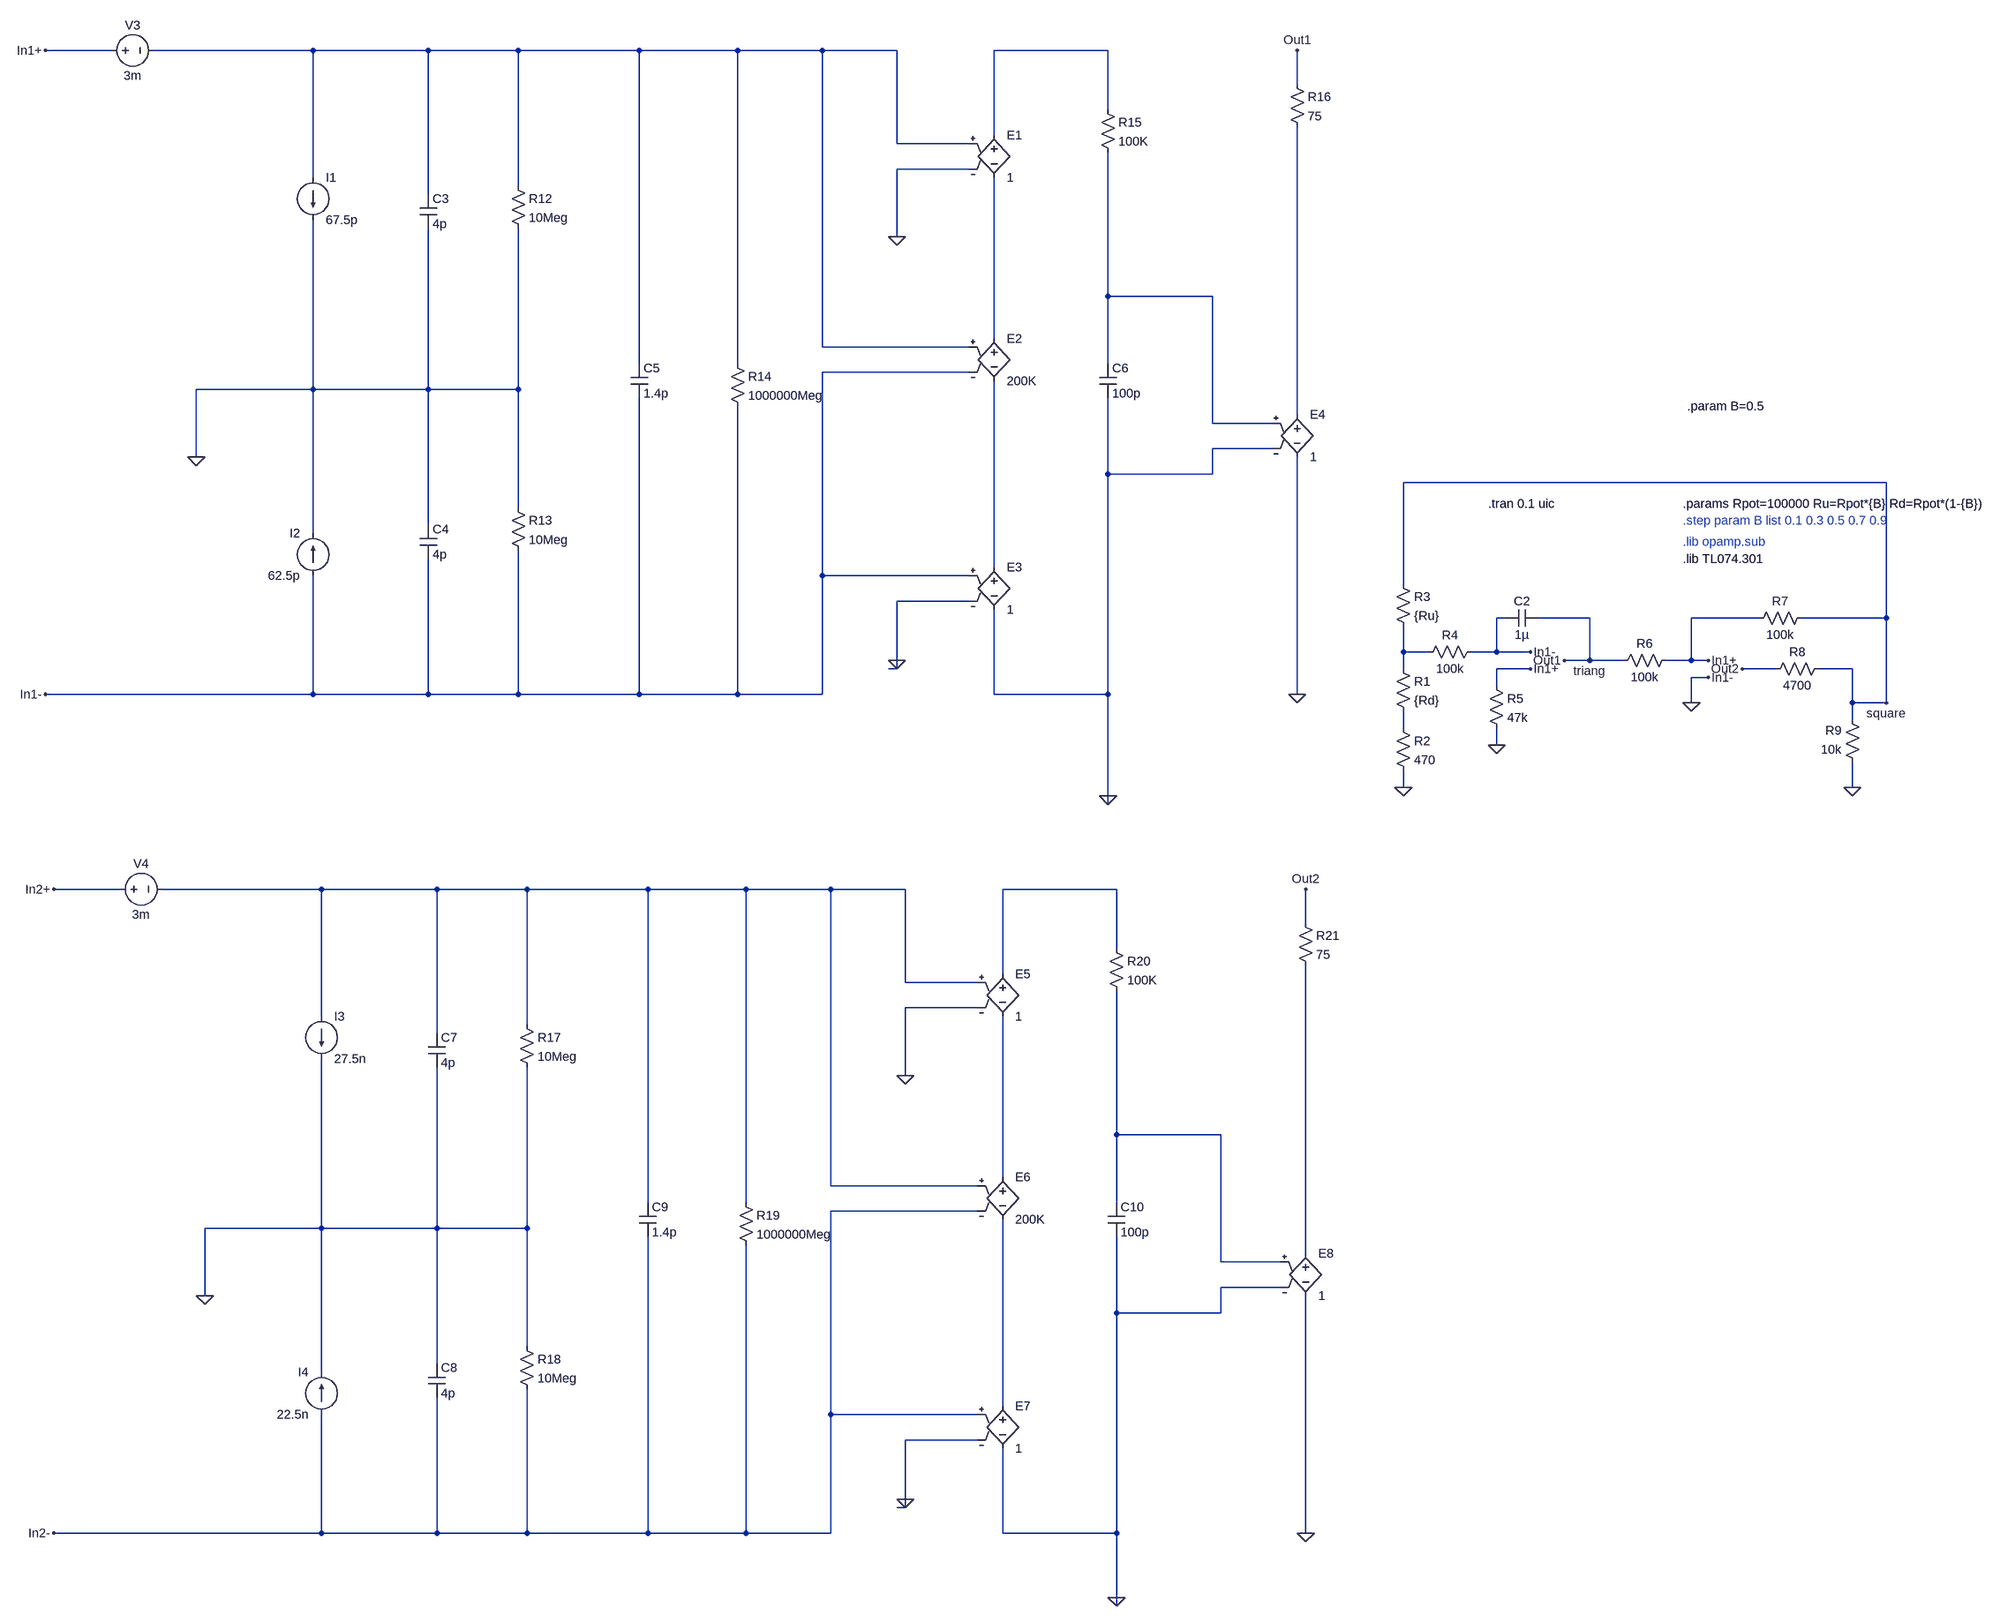
[diagram p0: schematic LFO_macromodel.asc]
LFO_macromodel.asc, the LTspice schematic file:
Version 4
SHEET 1 1796 2212
WIRE -3808 -800 -3936 -800
WIRE -3424 -800 -3728 -800
WIRE -3008 -800 -3424 -800
WIRE -2608 -800 -3008 -800
WIRE -2288 -800 -2608 -800
WIRE -1984 -800 -2288 -800
WIRE -1824 -800 -1984 -800
WIRE -1600 -800 -1824 -800
WIRE -1008 -800 -1408 -800
WIRE -384 -736 -384 -800
WIRE -1008 -688 -1008 -800
WIRE -1408 -640 -1408 -800
WIRE -1600 -624 -1600 -800
WIRE -1456 -624 -1600 -624
WIRE -1456 -576 -1600 -576
WIRE -3424 -560 -3424 -800
WIRE -2608 -544 -2608 -800
WIRE -3008 -528 -3008 -800
WIRE -1600 -448 -1600 -576
WIRE -1600 -448 -1616 -448
WIRE -1008 -336 -1008 -608
WIRE -544 -336 -1008 -336
WIRE -1408 -256 -1408 -560
WIRE -1824 -240 -1824 -800
WIRE -1456 -240 -1824 -240
WIRE -2288 -208 -2288 -800
WIRE -1984 -208 -1984 -800
WIRE -1008 -208 -1008 -336
WIRE -1456 -192 -1824 -192
WIRE -3424 -160 -3424 -480
WIRE -3424 -160 -3648 -160
WIRE -3008 -160 -3008 -464
WIRE -3008 -160 -3424 -160
WIRE -2608 -160 -2608 -464
WIRE -2608 -160 -3008 -160
WIRE -384 -112 -384 -656
WIRE -544 -96 -544 -336
WIRE -432 -96 -544 -96
WIRE -432 -48 -544 -48
WIRE -3648 -32 -3648 -160
WIRE -1008 0 -1008 -144
WIRE -544 0 -544 -48
WIRE -544 0 -1008 0
WIRE 880 16 -32 16
WIRE -2608 64 -2608 -160
WIRE -3008 96 -3008 -160
WIRE -3424 112 -3424 -160
WIRE -1408 176 -1408 -176
WIRE -1824 192 -1824 -192
WIRE -1456 192 -1824 192
WIRE -32 208 -32 16
WIRE -1456 240 -1600 240
WIRE 160 272 144 272
WIRE 320 272 224 272
WIRE 640 272 512 272
WIRE 880 272 880 16
WIRE 880 272 720 272
WIRE -32 336 -32 288
WIRE 16 336 -32 336
WIRE 144 336 144 272
WIRE 144 336 96 336
WIRE 208 336 144 336
WIRE -1600 352 -1600 240
WIRE 320 352 320 272
WIRE 320 352 272 352
WIRE 384 352 320 352
WIRE 512 352 512 272
WIRE 512 352 464 352
WIRE 544 352 512 352
WIRE -1600 368 -1600 352
WIRE -1600 368 -1616 368
WIRE -32 368 -32 336
WIRE 208 368 144 368
WIRE 672 368 608 368
WIRE 816 368 752 368
WIRE 544 384 512 384
WIRE 144 400 144 368
WIRE -3424 416 -3424 192
WIRE -3424 416 -3936 416
WIRE -3008 416 -3008 160
WIRE -3008 416 -3424 416
WIRE -2608 416 -2608 144
WIRE -2608 416 -3008 416
WIRE -2288 416 -2288 -144
WIRE -2288 416 -2608 416
WIRE -1984 416 -1984 -128
WIRE -1984 416 -2288 416
WIRE -1824 416 -1824 192
WIRE -1824 416 -1984 416
WIRE -1408 416 -1408 256
WIRE -1008 416 -1008 0
WIRE -1008 416 -1408 416
WIRE -384 416 -384 -32
WIRE 512 432 512 384
WIRE 816 432 816 368
WIRE 880 432 880 272
WIRE 880 432 816 432
WIRE 816 464 816 432
WIRE -32 480 -32 448
WIRE 144 512 144 480
WIRE -32 592 -32 560
WIRE 816 592 816 544
WIRE -1008 608 -1008 416
WIRE -1008 624 -1008 608
WIRE -3792 784 -3920 784
WIRE -3408 784 -3712 784
WIRE -2992 784 -3408 784
WIRE -2592 784 -2992 784
WIRE -2272 784 -2592 784
WIRE -1968 784 -2272 784
WIRE -1808 784 -1968 784
WIRE -1584 784 -1808 784
WIRE -992 784 -1392 784
WIRE -368 848 -368 784
WIRE -992 896 -992 784
WIRE -1392 944 -1392 784
WIRE -1584 960 -1584 784
WIRE -1440 960 -1584 960
WIRE -1440 1008 -1584 1008
WIRE -3408 1024 -3408 784
WIRE -2592 1040 -2592 784
WIRE -2992 1056 -2992 784
WIRE -1584 1136 -1584 1008
WIRE -1584 1136 -1600 1136
WIRE -992 1248 -992 976
WIRE -528 1248 -992 1248
WIRE -1392 1328 -1392 1024
WIRE -1808 1344 -1808 784
WIRE -1440 1344 -1808 1344
WIRE -2272 1376 -2272 784
WIRE -1968 1376 -1968 784
WIRE -992 1376 -992 1248
WIRE -1440 1392 -1808 1392
WIRE -3408 1424 -3408 1104
WIRE -3408 1424 -3632 1424
WIRE -2992 1424 -2992 1120
WIRE -2992 1424 -3408 1424
WIRE -2592 1424 -2592 1120
WIRE -2592 1424 -2992 1424
WIRE -368 1472 -368 928
WIRE -528 1488 -528 1248
WIRE -416 1488 -528 1488
WIRE -416 1536 -528 1536
WIRE -3632 1552 -3632 1424
WIRE -992 1584 -992 1440
WIRE -528 1584 -528 1536
WIRE -528 1584 -992 1584
WIRE -2592 1648 -2592 1424
WIRE -2992 1680 -2992 1424
WIRE -3408 1696 -3408 1424
WIRE -1392 1760 -1392 1408
WIRE -1808 1776 -1808 1392
WIRE -1440 1776 -1808 1776
WIRE -1440 1824 -1584 1824
WIRE -1584 1936 -1584 1824
WIRE -1584 1952 -1584 1936
WIRE -1584 1952 -1600 1952
WIRE -3408 2000 -3408 1776
WIRE -3408 2000 -3920 2000
WIRE -2992 2000 -2992 1744
WIRE -2992 2000 -3408 2000
WIRE -2592 2000 -2592 1728
WIRE -2592 2000 -2992 2000
WIRE -2272 2000 -2272 1440
WIRE -2272 2000 -2592 2000
WIRE -1968 2000 -1968 1456
WIRE -1968 2000 -2272 2000
WIRE -1808 2000 -1808 1776
WIRE -1808 2000 -1968 2000
WIRE -1392 2000 -1392 1840
WIRE -992 2000 -992 1584
WIRE -992 2000 -1392 2000
WIRE -368 2000 -368 1552
WIRE -992 2192 -992 2000
WIRE -992 2208 -992 2192
FLAG -32 592 0
FLAG 144 512 0
FLAG 512 432 0
FLAG 816 592 0
FLAG 320 352 triang
FLAG 880 432 square
FLAG -1008 608 0
FLAG -384 416 0
FLAG -3648 -32 0
FLAG -1600 -448 0
FLAG -1600 352 0
FLAG -3936 -800 In1+
FLAG -3936 416 In1-
FLAG -384 -800 Out1
FLAG -992 2192 0
FLAG -368 2000 0
FLAG -3632 1552 0
FLAG -1584 1136 0
FLAG -1584 1936 0
FLAG -3920 784 In2+
FLAG -3920 2000 In2-
FLAG -368 784 Out2
FLAG 208 368 In1+
FLAG 208 336 In1-
FLAG 272 352 Out1
FLAG 544 352 In1+
FLAG 544 384 In1-
FLAG 608 368 Out2
SYMBOL res -48 352 R0
SYMATTR InstName R1
SYMATTR Value {Rd}
SYMBOL res -48 464 R0
SYMATTR InstName R2
SYMATTR Value 470
SYMBOL res -48 192 R0
SYMATTR InstName R3
SYMATTR Value {Ru}
SYMBOL res 112 320 R90
WINDOW 0 0 56 VBottom 2
WINDOW 3 32 56 VTop 2
SYMATTR InstName R4
SYMATTR Value 100k
SYMBOL res 128 384 R0
SYMATTR InstName R5
SYMATTR Value 47k
SYMBOL res 480 336 R90
WINDOW 0 0 56 VBottom 2
WINDOW 3 32 56 VTop 2
SYMATTR InstName R6
SYMATTR Value 100k
SYMBOL res 736 256 R90
WINDOW 0 0 56 VBottom 2
WINDOW 3 32 56 VTop 2
SYMATTR InstName R7
SYMATTR Value 100k
SYMBOL res 768 352 R90
WINDOW 0 0 56 VBottom 2
WINDOW 3 32 56 VTop 2
SYMATTR InstName R8
SYMATTR Value 4700
SYMBOL res 832 560 R180
WINDOW 0 36 76 Left 2
WINDOW 3 36 40 Left 2
SYMATTR InstName R9
SYMATTR Value 10k
SYMBOL cap 224 256 R90
WINDOW 0 0 32 VBottom 2
WINDOW 3 32 32 VTop 2
SYMATTR InstName C2
SYMATTR Value 1µ
SYMBOL /e -1408 -656 R0
SYMATTR InstName E1
SYMATTR Value 1
SYMBOL /e -1408 -272 R0
SYMATTR InstName E2
SYMATTR Value 200K
SYMBOL /e -1408 160 R0
SYMATTR InstName E3
SYMATTR Value 1
SYMBOL /e -384 -128 R0
SYMATTR InstName E4
SYMATTR Value 1
SYMBOL /current -3424 -560 R0
SYMATTR InstName I1
SYMATTR Value 67.5p
SYMBOL /current -3424 192 R180
WINDOW 0 24 80 Left 2
WINDOW 3 24 0 Left 2
SYMATTR InstName I2
SYMATTR Value 62.5p
SYMBOL /cap -3024 -528 R0
SYMATTR InstName C3
SYMATTR Value 4p
SYMBOL /cap -3024 96 R0
SYMATTR InstName C4
SYMATTR Value 4p
SYMBOL /cap -2304 -208 R0
SYMATTR InstName C5
SYMATTR Value 1.4p
SYMBOL /cap -1024 -208 R0
SYMATTR InstName C6
SYMATTR Value 100p
SYMBOL /res -2624 -560 R0
SYMATTR InstName R12
SYMATTR Value 10Meg
SYMBOL /res -2624 48 R0
SYMATTR InstName R13
SYMATTR Value 10Meg
SYMBOL /res -2000 -224 R0
SYMATTR InstName R14
SYMATTR Value 1000000Meg
SYMBOL /res -1024 -704 R0
SYMATTR InstName R15
SYMATTR Value 100K
SYMBOL /res -400 -752 R0
SYMATTR InstName R16
SYMATTR Value 75
SYMBOL voltage -3824 -800 R270
WINDOW 0 32 56 VTop 2
WINDOW 3 -32 56 VBottom 2
SYMATTR InstName V3
SYMATTR Value 3m
SYMBOL /e -1392 928 R0
SYMATTR InstName E5
SYMATTR Value 1
SYMBOL /e -1392 1312 R0
SYMATTR InstName E6
SYMATTR Value 200K
SYMBOL /e -1392 1744 R0
SYMATTR InstName E7
SYMATTR Value 1
SYMBOL /e -368 1456 R0
SYMATTR InstName E8
SYMATTR Value 1
SYMBOL /current -3408 1024 R0
SYMATTR InstName I3
SYMATTR Value 27.5n
SYMBOL /current -3408 1776 R180
WINDOW 0 24 80 Left 2
WINDOW 3 24 0 Left 2
SYMATTR InstName I4
SYMATTR Value 22.5n
SYMBOL /cap -3008 1056 R0
SYMATTR InstName C7
SYMATTR Value 4p
SYMBOL /cap -3008 1680 R0
SYMATTR InstName C8
SYMATTR Value 4p
SYMBOL /cap -2288 1376 R0
SYMATTR InstName C9
SYMATTR Value 1.4p
SYMBOL /cap -1008 1376 R0
SYMATTR InstName C10
SYMATTR Value 100p
SYMBOL /res -2608 1024 R0
SYMATTR InstName R17
SYMATTR Value 10Meg
SYMBOL /res -2608 1632 R0
SYMATTR InstName R18
SYMATTR Value 10Meg
SYMBOL /res -1984 1360 R0
SYMATTR InstName R19
SYMATTR Value 1000000Meg
SYMBOL /res -1008 880 R0
SYMATTR InstName R20
SYMATTR Value 100K
SYMBOL /res -384 832 R0
SYMATTR InstName R21
SYMATTR Value 75
SYMBOL voltage -3808 784 R270
WINDOW 0 32 56 VTop 2
WINDOW 3 -32 56 VBottom 2
SYMATTR InstName V4
SYMATTR Value 3m
TEXT 496 56 Left 2 !.params Rpot=100000 Ru=Rpot*{B} Rd=Rpot*(1-{B})
TEXT 496 88 Left 2 ;.step param B list 0.1 0.3 0.5 0.7 0.9
TEXT 496 128 Left 2 ;.lib opamp.sub
TEXT 128 56 Left 2 !.tran 0.1 uic
TEXT 496 160 Left 2 !.lib TL074.301
TEXT 504 -128 Left 2 !.param B=0.5

The netlist it stands for:
* LFO_macromodel.asc
R1 N007 N008 {Rd}
R2 N008 0 470
R3 square N007 {Ru}
R4 0 N007 100k
R5 In1+ 0 47k
R6 In1+ Out1 100k
R7 square In1+ 100k
R8 square Out2 4700
R9 0 square 10k
C2 Out1 0 1µ
E1 N002 N004 N001 0 1
E2 N004 N006 N001 0 200K
E3 N006 0 0 0 1
E4 N005 0 N003 0 1
I1 N001 0 67.5p
I2 0 0 62.5p
C3 N001 0 4p
C4 0 0 4p
C5 N001 0 1.4p
C6 N003 0 100p
R12 N001 0 10Meg
R13 0 0 10Meg
R14 N001 0 1000000Meg
R15 N002 N003 100K
R16 Out1 N005 75
V3 In1+ N001 3m
E5 N010 N012 N009 0 1
E6 N012 N014 N009 In2- 200K
E7 N014 0 In2- 0 1
E8 N013 0 N011 0 1
I3 N009 0 27.5n
I4 In2- 0 22.5n
C7 N009 0 4p
C8 0 In2- 4p
C9 N009 In2- 1.4p
C10 N011 0 100p
R17 N009 0 10Meg
R18 0 In2- 10Meg
R19 N009 In2- 1000000Meg
R20 N010 N011 100K
R21 Out2 N013 75
V4 In2+ N009 3m
.params Rpot=100000 Ru=Rpot*{B} Rd=Rpot*(1-{B})
* .step param B list 0.1 0.3 0.5 0.7 0.9
* .lib opamp.sub
.tran 0.1 uic
.lib TL074.301
.param B=0.5
.backanno
.end